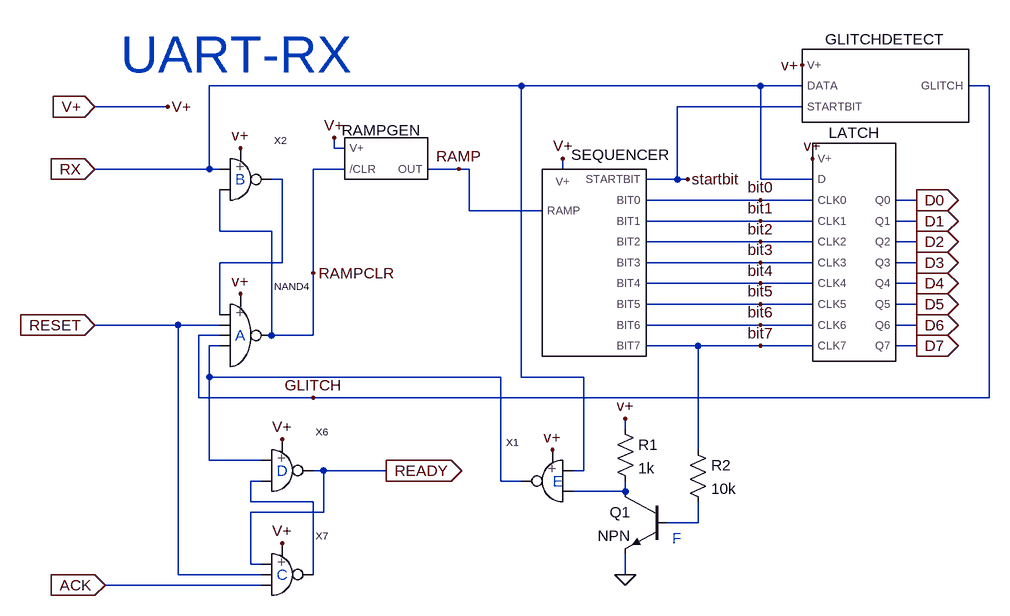
[diagram p0: schematic UART-RX.asc]
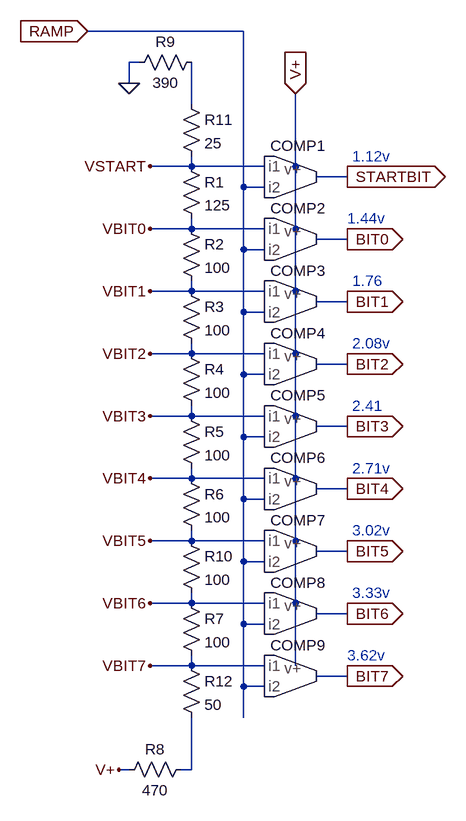
[diagram p1: sub-circuit uart-rx-sequencer.asc]
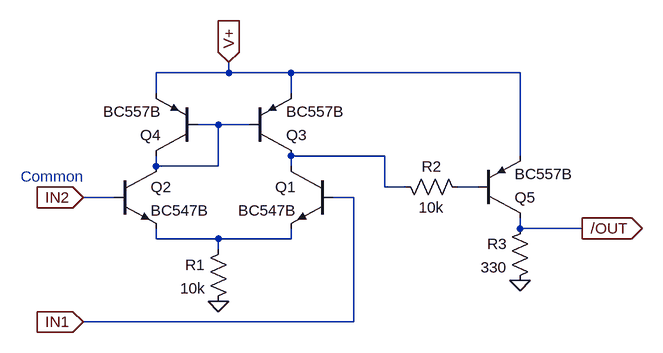
[diagram p2: sub-circuit comparator.asc]
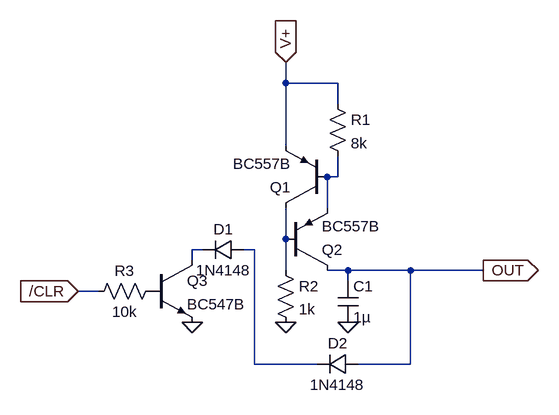
[diagram p3: sub-circuit rampgen.asc]
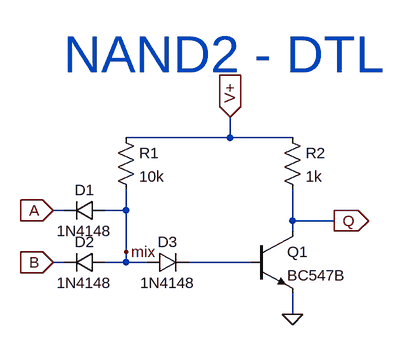
[diagram p4: sub-circuit nand2.asc]
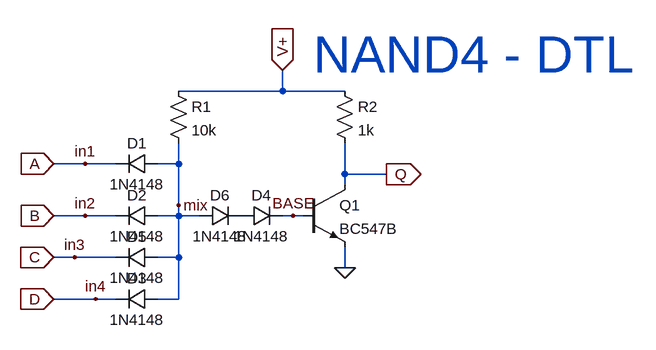
[diagram p5: sub-circuit nand4.asc]
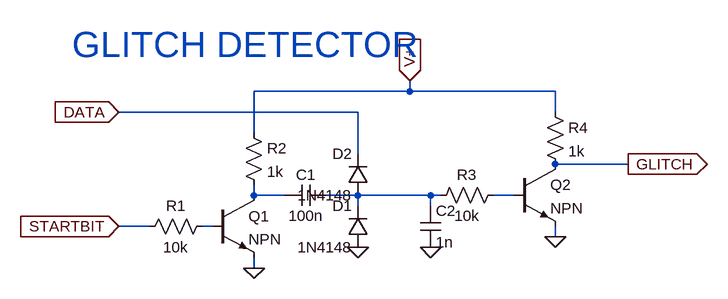
[diagram p6: sub-circuit glitchdetector.asc]
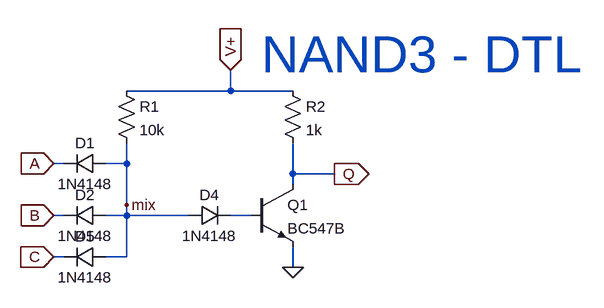
[diagram p7: sub-circuit nand3.asc]
UART-RX.asc, the LTspice schematic file:
Version 4
SHEET 1 1972 1096
WIRE 880 128 400 128
WIRE 1248 128 880 128
WIRE 1312 128 1248 128
WIRE 1600 128 1568 128
WIRE 336 160 224 160
WIRE 1312 160 1120 160
WIRE 592 224 592 208
WIRE 608 224 592 224
WIRE 400 256 400 128
WIRE 400 256 224 256
WIRE 416 256 400 256
WIRE 608 256 560 256
WIRE 784 256 736 256
WIRE 800 256 784 256
WIRE 944 256 944 240
WIRE 512 272 496 272
WIRE 1120 272 1120 160
WIRE 1120 272 1072 272
WIRE 1136 272 1120 272
WIRE 1248 272 1248 128
WIRE 1328 272 1248 272
WIRE 1248 304 1072 304
WIRE 1328 304 1248 304
WIRE 1488 304 1456 304
WIRE 800 320 800 256
WIRE 912 320 800 320
WIRE 1248 336 1072 336
WIRE 1328 336 1248 336
WIRE 1488 336 1456 336
WIRE 416 352 416 288
WIRE 496 352 416 352
WIRE 1248 368 1072 368
WIRE 1328 368 1248 368
WIRE 1488 368 1456 368
WIRE 512 400 512 272
WIRE 512 400 416 400
WIRE 1248 400 1072 400
WIRE 1328 400 1248 400
WIRE 1488 400 1456 400
WIRE 560 416 560 256
WIRE 1248 432 1072 432
WIRE 1328 432 1248 432
WIRE 1488 432 1456 432
WIRE 1248 464 1072 464
WIRE 1328 464 1248 464
WIRE 1488 464 1456 464
WIRE 416 480 416 400
WIRE 352 496 224 496
WIRE 416 496 352 496
WIRE 1248 496 1072 496
WIRE 1328 496 1248 496
WIRE 1488 496 1456 496
WIRE 416 512 384 512
WIRE 496 512 496 352
WIRE 560 512 560 416
WIRE 560 512 496 512
WIRE 416 528 400 528
WIRE 1152 528 1072 528
WIRE 1248 528 1152 528
WIRE 1328 528 1248 528
WIRE 1488 528 1456 528
WIRE 400 576 400 528
WIRE 848 576 400 576
WIRE 880 576 880 128
WIRE 976 576 880 576
WIRE 384 608 384 512
WIRE 560 608 384 608
WIRE 1600 608 1600 128
WIRE 1600 608 560 608
WIRE 1040 656 1040 640
WIRE 1152 688 1152 528
WIRE 400 704 400 576
WIRE 480 704 400 704
WIRE 576 720 560 720
WIRE 672 720 576 720
WIRE 976 720 976 576
WIRE 976 720 960 720
WIRE 480 736 464 736
WIRE 848 736 848 576
WIRE 880 736 848 736
WIRE 1040 752 1040 736
WIRE 1040 752 960 752
WIRE 464 768 464 736
WIRE 560 768 464 768
WIRE 576 784 576 720
WIRE 576 784 464 784
WIRE 1152 800 1152 768
WIRE 1152 800 1104 800
WIRE 464 864 464 784
WIRE 480 864 464 864
WIRE 352 880 352 496
WIRE 480 880 352 880
WIRE 560 880 560 768
WIRE 1040 880 1040 848
WIRE 480 896 240 896
FLAG 448 448 v+
FLAG 448 224 v+
FLAG 944 240 V+
FLAG 592 208 V+
FLAG 1312 96 v+
FLAG 512 672 V+
FLAG 512 832 V+
FLAG 672 720 READY
IOPIN 672 720 Out
FLAG 1136 272 startbit
FLAG 240 896 ACK
IOPIN 240 896 In
FLAG 224 256 RX
IOPIN 224 256 In
FLAG 224 496 RESET
IOPIN 224 496 In
FLAG 784 256 RAMP
FLAG 336 160 V+
FLAG 224 160 V+
IOPIN 224 160 In
FLAG 560 608 GLITCH
FLAG 1328 240 v+
FLAG 1488 304 D0
IOPIN 1488 304 Out
FLAG 1488 336 D1
IOPIN 1488 336 Out
FLAG 1488 368 D2
IOPIN 1488 368 Out
FLAG 1488 400 D3
IOPIN 1488 400 Out
FLAG 1488 432 D4
IOPIN 1488 432 Out
FLAG 1488 464 D5
IOPIN 1488 464 Out
FLAG 1488 496 D6
IOPIN 1488 496 Out
FLAG 1488 528 D7
IOPIN 1488 528 Out
FLAG 1248 304 bit0
FLAG 1248 336 bit1
FLAG 1248 368 bit2
FLAG 1248 400 bit3
FLAG 1248 432 bit4
FLAG 1248 464 bit5
FLAG 1248 496 bit6
FLAG 1248 528 bit7
FLAG 560 416 RAMPCLR
FLAG 928 688 v+
FLAG 1040 880 0
FLAG 1040 640 v+
SYMBOL UART-Rx-Sequencer 960 384 R0
WINDOW 0 72 -134 Bottom 2
SYMATTR InstName SEQUENCER
SYMBOL RampGen 656 256 R0
SYMATTR InstName RAMPGEN
SYMBOL NAND2 448 272 R0
SYMATTR InstName X2
SYMBOL NAND4 448 496 R0
SYMATTR InstName NAND4
SYMBOL GlitchDetector 1440 128 R0
SYMATTR InstName GLITCHDETECT
SYMBOL NAND2 512 720 R0
SYMATTR InstName X6
SYMBOL NAND3 512 880 R0
SYMATTR InstName X7
SYMBOL Octal-D-Latch 1392 384 R0
SYMATTR InstName LATCH
SYMBOL NAND2 928 736 M0
SYMATTR InstName X1
SYMBOL npn 1104 752 M0
SYMATTR InstName Q1
SYMBOL res 1024 640 R0
SYMATTR InstName R1
SYMATTR Value 1k
SYMBOL res 1136 672 R0
SYMATTR InstName R2
SYMATTR Value 10k
TEXT 264 80 Left 6 ;UART-RX
TEXT 440 512 Left 2 ;A
TEXT 440 272 Left 2 ;B
TEXT 504 880 Left 2 ;C
TEXT 504 720 Left 2 ;D
TEXT 928 736 Left 2 ;E
TEXT 1112 824 Left 2 ;F

uart-rx-sequencer.asc, the sub-circuit schematic file:
Version 4
SHEET 1 880 1152
WIRE 128 -192 -112 -192
WIRE -32 -144 -48 -144
WIRE -48 -112 -48 -144
WIRE 48 -80 48 -144
WIRE 48 16 48 0
WIRE 48 16 -16 16
WIRE 160 16 48 16
WIRE 208 16 208 -96
WIRE 288 32 240 32
WIRE 128 48 128 -192
WIRE 160 48 128 48
WIRE 48 112 48 96
WIRE 48 112 -16 112
WIRE 160 112 48 112
WIRE 208 112 208 16
WIRE 288 128 240 128
WIRE 128 144 128 48
WIRE 160 144 128 144
WIRE 48 208 48 192
WIRE 48 208 -16 208
WIRE 160 208 48 208
WIRE 208 208 208 112
WIRE 288 224 240 224
WIRE 128 240 128 144
WIRE 160 240 128 240
WIRE 48 304 48 288
WIRE 48 304 -16 304
WIRE 160 304 48 304
WIRE 208 304 208 208
WIRE 288 320 240 320
WIRE 128 336 128 240
WIRE 160 336 128 336
WIRE 48 400 48 384
WIRE 48 400 -16 400
WIRE 160 400 48 400
WIRE 208 400 208 304
WIRE 288 416 240 416
WIRE 128 432 128 336
WIRE 160 432 128 432
WIRE 48 496 48 480
WIRE 48 496 -16 496
WIRE 160 496 48 496
WIRE 208 496 208 400
WIRE 288 512 240 512
WIRE 128 528 128 432
WIRE 160 528 128 528
WIRE 48 592 48 576
WIRE 48 592 -16 592
WIRE 160 592 48 592
WIRE 208 592 208 496
WIRE 288 608 240 608
WIRE 128 624 128 528
WIRE 160 624 128 624
WIRE 48 688 48 672
WIRE 48 688 -16 688
WIRE 160 688 48 688
WIRE 208 688 208 592
WIRE 288 704 240 704
WIRE 128 720 128 624
WIRE 160 720 128 720
WIRE 48 784 48 768
WIRE 48 784 -16 784
WIRE 160 784 48 784
WIRE 208 784 208 688
WIRE 288 800 240 800
WIRE 128 816 128 720
WIRE 160 816 128 816
WIRE 128 864 128 816
WIRE -48 944 -64 944
WIRE 48 944 48 864
WIRE 48 944 32 944
FLAG 288 32 STARTBIT
IOPIN 288 32 Out
FLAG 288 128 BIT0
IOPIN 288 128 Out
FLAG 288 224 BIT1
IOPIN 288 224 Out
FLAG 288 320 BIT2
IOPIN 288 320 Out
FLAG 288 416 BIT3
IOPIN 288 416 Out
FLAG 288 512 BIT4
IOPIN 288 512 Out
FLAG 288 608 BIT5
IOPIN 288 608 Out
FLAG 288 704 BIT6
IOPIN 288 704 Out
FLAG 288 800 BIT7
IOPIN 288 800 Out
FLAG 208 -96 V+
IOPIN 208 -96 In
FLAG -112 -192 RAMP
IOPIN -112 -192 In
FLAG -48 -112 0
FLAG -64 944 V+
FLAG -16 16 VSTART
FLAG -16 112 VBIT0
FLAG -16 208 VBIT1
FLAG -16 304 VBIT2
FLAG -16 400 VBIT3
FLAG -16 496 VBIT4
FLAG -16 592 VBIT5
FLAG -16 688 VBIT6
FLAG -16 784 VBIT7
SYMBOL res 32 0 R0
SYMATTR InstName R1
SYMATTR Value 125
SYMBOL res 32 96 R0
SYMATTR InstName R2
SYMATTR Value 100
SYMBOL res 32 192 R0
SYMATTR InstName R3
SYMATTR Value 100
SYMBOL res 32 288 R0
SYMATTR InstName R4
SYMATTR Value 100
SYMBOL res 32 384 R0
SYMATTR InstName R5
SYMATTR Value 100
SYMBOL res 32 480 R0
SYMATTR InstName R6
SYMATTR Value 100
SYMBOL res 32 672 R0
SYMATTR InstName R7
SYMATTR Value 100
SYMBOL res 48 928 R90
WINDOW 0 0 56 VBottom 2
WINDOW 3 32 56 VTop 2
SYMATTR InstName R8
SYMATTR Value 470
SYMBOL res -48 -128 R270
WINDOW 0 32 56 VTop 2
WINDOW 3 0 56 VBottom 2
SYMATTR InstName R9
SYMATTR Value 390
SYMBOL res 32 576 R0
SYMATTR InstName R10
SYMATTR Value 100
SYMBOL Comparator 240 32 R0
SYMATTR InstName COMP1
SYMBOL Comparator 240 128 R0
SYMATTR InstName COMP2
SYMBOL Comparator 240 224 R0
SYMATTR InstName COMP3
SYMBOL Comparator 240 320 R0
SYMATTR InstName COMP4
SYMBOL Comparator 240 416 R0
SYMATTR InstName COMP5
SYMBOL Comparator 240 512 R0
SYMATTR InstName COMP6
SYMBOL Comparator 240 608 R0
SYMATTR InstName COMP7
SYMBOL Comparator 240 704 R0
SYMATTR InstName COMP8
SYMBOL Comparator 240 800 R0
SYMATTR InstName COMP9
SYMBOL res 32 -96 R0
SYMATTR InstName R11
SYMATTR Value 25
SYMBOL res 32 768 R0
SYMATTR InstName R12
SYMATTR Value 50
TEXT 296 0 Left 2 ;1.12v
TEXT 288 96 Left 2 ;1.44v
TEXT 296 192 Left 2 ;1.76
TEXT 296 288 Left 2 ;2.08v
TEXT 296 384 Left 2 ;2.41
TEXT 296 480 Left 2 ;2.71v
TEXT 296 576 Left 2 ;3.02v
TEXT 296 672 Left 2 ;3.33v
TEXT 288 768 Left 2 ;3.62v

comparator.asc, the sub-circuit schematic file:
Version 4
SHEET 1 1272 680
WIRE -32 -16 -32 -32
WIRE -32 -16 -144 -16
WIRE 64 -16 -32 -16
WIRE 416 -16 64 -16
WIRE -144 16 -144 -16
WIRE 64 16 64 -16
WIRE -48 64 -80 64
WIRE 0 64 -48 64
WIRE 208 112 64 112
WIRE 416 112 416 -16
WIRE -144 128 -144 112
WIRE -48 128 -48 64
WIRE -48 128 -144 128
WIRE 64 128 64 112
WIRE 208 160 208 112
WIRE 240 160 208 160
WIRE 352 160 320 160
WIRE -208 176 -256 176
WIRE 160 176 128 176
WIRE 416 224 416 208
WIRE 512 224 416 224
WIRE -144 240 -144 224
WIRE -48 240 -144 240
WIRE 64 240 64 224
WIRE 64 240 -48 240
WIRE -48 256 -48 240
WIRE 160 368 160 176
WIRE 160 368 -256 368
FLAG -48 336 0
FLAG 416 304 0
FLAG 512 224 /OUT
IOPIN 512 224 Out
FLAG -32 -32 V+
IOPIN -32 -32 In
FLAG -256 176 IN2
IOPIN -256 176 In
FLAG -256 368 IN1
IOPIN -256 368 In
SYMBOL npn 128 128 M0
SYMATTR InstName Q1
SYMATTR Value BC547B
SYMBOL pnp -80 112 R180
SYMATTR InstName Q4
SYMATTR Value BC557B
SYMBOL res -32 240 M0
SYMATTR InstName R1
SYMATTR Value 10k
SYMBOL npn -208 128 R0
SYMATTR InstName Q2
SYMATTR Value BC547B
SYMBOL res 432 208 M0
SYMATTR InstName R3
SYMATTR Value 330
SYMBOL res 224 144 M90
WINDOW 0 0 56 VBottom 2
WINDOW 3 32 56 VTop 2
SYMATTR InstName R2
SYMATTR Value 10k
SYMBOL pnp 0 112 M180
SYMATTR InstName Q3
SYMATTR Value BC557B
SYMBOL pnp 352 208 M180
SYMATTR InstName Q5
SYMATTR Value BC557B
TEXT -352 144 Left 2 ;Common

rampgen.asc, the sub-circuit schematic file:
Version 4
SHEET 1 1276 1184
WIRE 832 -64 832 -96
WIRE 912 -64 832 -64
WIRE 912 -32 912 -64
WIRE 832 32 832 -64
WIRE 912 80 912 48
WIRE 912 80 896 80
WIRE 896 128 896 80
WIRE 832 176 832 128
WIRE 704 192 688 192
WIRE 784 192 768 192
WIRE 688 208 688 192
WIRE 832 224 832 176
WIRE 928 224 896 224
WIRE 1024 224 928 224
WIRE 1136 224 1024 224
WIRE 928 240 928 224
WIRE 544 256 512 256
WIRE 784 368 784 192
WIRE 880 368 784 368
WIRE 1024 368 1024 224
WIRE 1024 368 944 368
FLAG 688 304 0
FLAG 512 256 /CLR
IOPIN 512 256 In
FLAG 832 304 0
FLAG 832 -96 V+
IOPIN 832 -96 In
FLAG 928 304 0
FLAG 1136 224 OUT
IOPIN 1136 224 Out
SYMBOL npn 624 208 R0
SYMATTR InstName Q3
SYMATTR Value BC547B
SYMBOL res 640 240 R90
WINDOW 0 0 56 VBottom 2
WINDOW 3 32 56 VTop 2
SYMATTR InstName R3
SYMATTR Value 10k
SYMBOL pnp 832 224 M180
SYMATTR InstName Q2
SYMATTR Value BC557B
SYMBOL pnp 896 128 R180
SYMATTR InstName Q1
SYMATTR Value BC557B
SYMBOL res 816 208 R0
SYMATTR InstName R2
SYMATTR Value 1k
SYMBOL cap 912 240 R0
SYMATTR InstName C1
SYMATTR Value 1µ
SYMBOL res 896 -48 R0
SYMATTR InstName R1
SYMATTR Value 8k
SYMBOL diode 768 176 R90
WINDOW 0 0 32 VBottom 2
WINDOW 3 32 32 VTop 2
SYMATTR InstName D1
SYMATTR Value 1N4148
SYMBOL diode 944 352 R90
WINDOW 0 0 32 VBottom 2
WINDOW 3 32 32 VTop 2
SYMATTR InstName D2
SYMATTR Value 1N4148

nand2.asc, the sub-circuit schematic file:
Version 4
SHEET 1 880 680
WIRE 288 -48 288 -80
WIRE 288 -48 128 -48
WIRE 384 -48 288 -48
WIRE 32 64 16 64
WIRE 128 64 128 32
WIRE 128 64 96 64
WIRE 384 80 384 32
WIRE 448 80 384 80
WIRE 384 96 384 80
WIRE 128 128 128 64
WIRE 32 144 16 144
WIRE 128 144 128 128
WIRE 128 144 96 144
WIRE 160 144 128 144
WIRE 320 144 224 144
WIRE 384 224 384 192
FLAG 384 224 0
FLAG 448 80 Q
IOPIN 448 80 Out
FLAG 16 64 A
IOPIN 16 64 In
FLAG 16 144 B
IOPIN 16 144 In
FLAG 288 -80 V+
IOPIN 288 -80 In
FLAG 128 128 mix
SYMBOL diode 96 48 R90
WINDOW 0 0 32 VBottom 2
WINDOW 3 32 32 VTop 2
SYMATTR InstName D1
SYMATTR Value 1N4148
SYMBOL res 112 -64 R0
SYMATTR InstName R1
SYMATTR Value 10k
SYMBOL npn 320 96 R0
SYMATTR InstName Q1
SYMATTR Value BC547B
SYMBOL res 368 -64 R0
SYMATTR InstName R2
SYMATTR Value 1k
SYMBOL diode 96 128 R90
WINDOW 0 0 32 VBottom 2
WINDOW 3 32 32 VTop 2
SYMATTR InstName D2
SYMATTR Value 1N4148
SYMBOL diode 160 160 R270
WINDOW 0 32 32 VTop 2
WINDOW 3 0 32 VBottom 2
SYMATTR InstName D3
SYMATTR Value 1N4148
TEXT 32 -176 Left 6 ;NAND2 - DTL

nand4.asc, the sub-circuit schematic file:
Version 4
SHEET 1 880 680
WIRE 288 -48 288 -80
WIRE 288 -48 128 -48
WIRE 384 -48 288 -48
WIRE -16 64 -64 64
WIRE 32 64 -16 64
WIRE 128 64 128 32
WIRE 128 64 96 64
WIRE 384 80 384 32
WIRE 448 80 384 80
WIRE 384 96 384 80
WIRE 128 128 128 64
WIRE -16 144 -64 144
WIRE 32 144 -16 144
WIRE 128 144 128 128
WIRE 128 144 96 144
WIRE 160 144 128 144
WIRE 304 144 288 144
WIRE 320 144 304 144
WIRE -32 208 -64 208
WIRE 32 208 -32 208
WIRE 128 208 128 144
WIRE 128 208 96 208
WIRE 384 224 384 192
WIRE 0 272 -64 272
WIRE 32 272 0 272
WIRE 128 272 128 208
WIRE 128 272 96 272
FLAG 384 224 0
FLAG 448 80 Q
IOPIN 448 80 Out
FLAG -64 64 A
IOPIN -64 64 In
FLAG -64 144 B
IOPIN -64 144 In
FLAG 288 -80 V+
IOPIN 288 -80 In
FLAG 128 128 mix
FLAG -64 208 C
IOPIN -64 208 In
FLAG -64 272 D
IOPIN -64 272 In
FLAG 304 144 BASE
FLAG -16 64 in1
FLAG -16 144 in2
FLAG -32 208 in3
FLAG 0 272 in4
SYMBOL diode 96 48 R90
WINDOW 0 0 32 VBottom 2
WINDOW 3 32 32 VTop 2
SYMATTR InstName D1
SYMATTR Value 1N4148
SYMBOL res 112 -64 R0
SYMATTR InstName R1
SYMATTR Value 10k
SYMBOL npn 320 96 R0
SYMATTR InstName Q1
SYMATTR Value BC547B
SYMBOL res 368 -64 R0
SYMATTR InstName R2
SYMATTR Value 1k
SYMBOL diode 96 128 R90
WINDOW 0 0 32 VBottom 2
WINDOW 3 32 32 VTop 2
SYMATTR InstName D2
SYMATTR Value 1N4148
SYMBOL diode 224 160 R270
WINDOW 0 32 32 VTop 2
WINDOW 3 0 32 VBottom 2
SYMATTR InstName D4
SYMATTR Value 1N4148
SYMBOL diode 96 192 R90
WINDOW 0 0 32 VBottom 2
WINDOW 3 32 32 VTop 2
SYMATTR InstName D5
SYMATTR Value 1N4148
SYMBOL diode 96 256 R90
WINDOW 0 0 32 VBottom 2
WINDOW 3 32 32 VTop 2
SYMATTR InstName D3
SYMATTR Value 1N4148
SYMBOL diode 160 160 R270
WINDOW 0 32 32 VTop 2
WINDOW 3 0 32 VBottom 2
SYMATTR InstName D6
SYMATTR Value 1N4148
TEXT 336 -104 Left 6 ;NAND4 - DTL

glitchdetector.asc, the sub-circuit schematic file:
Version 4
SHEET 1 880 680
WIRE 256 -112 256 -128
WIRE 256 -112 16 -112
WIRE 480 -112 256 -112
WIRE 176 -80 -192 -80
WIRE 480 -80 480 -112
WIRE 16 -48 16 -112
WIRE 176 -16 176 -80
WIRE 592 0 480 0
WIRE 16 48 16 32
WIRE 64 48 16 48
WIRE 176 48 128 48
WIRE 288 48 176 48
WIRE 304 48 288 48
WIRE 416 48 384 48
WIRE 176 64 176 48
WIRE 288 64 288 48
WIRE -144 96 -192 96
WIRE -48 96 -64 96
WIRE 480 112 480 96
WIRE 16 160 16 144
FLAG 176 128 0
FLAG 480 112 0
FLAG 16 160 0
FLAG -192 96 STARTBIT
IOPIN -192 96 In
FLAG 256 -128 V+
IOPIN 256 -128 In
FLAG 592 0 GLITCH
IOPIN 592 0 Out
FLAG -192 -80 DATA
IOPIN -192 -80 In
FLAG 288 128 0
SYMBOL cap 128 32 R90
WINDOW 0 0 32 VBottom 2
WINDOW 3 32 32 VTop 2
SYMATTR InstName C1
SYMATTR Value 100n
SYMBOL diode 192 128 R180
WINDOW 0 24 64 Left 2
WINDOW 3 24 0 Left 2
SYMATTR InstName D1
SYMATTR Value 1N4148
SYMBOL diode 192 48 R180
WINDOW 0 24 64 Left 2
WINDOW 3 24 0 Left 2
SYMATTR InstName D2
SYMATTR Value 1N4148
SYMBOL npn 416 0 R0
SYMATTR InstName Q2
SYMBOL res 288 64 R270
WINDOW 0 32 56 VTop 2
WINDOW 3 0 56 VBottom 2
SYMATTR InstName R3
SYMATTR Value 10k
SYMBOL res 464 -96 R0
SYMATTR InstName R4
SYMATTR Value 1k
SYMBOL npn -48 48 R0
SYMATTR InstName Q1
SYMBOL res -160 112 R270
WINDOW 0 32 56 VTop 2
WINDOW 3 0 56 VBottom 2
SYMATTR InstName R1
SYMATTR Value 10k
SYMBOL res 0 -64 R0
SYMATTR InstName R2
SYMATTR Value 1k
SYMBOL cap 272 64 R0
SYMATTR InstName C2
SYMATTR Value 1n
TEXT -264 -184 Left 5 ;GLITCH DETECTOR

nand3.asc, the sub-circuit schematic file:
Version 4
SHEET 1 880 680
WIRE 288 -48 288 -80
WIRE 288 -48 128 -48
WIRE 384 -48 288 -48
WIRE 32 64 16 64
WIRE 128 64 128 32
WIRE 128 64 96 64
WIRE 384 80 384 32
WIRE 448 80 384 80
WIRE 384 96 384 80
WIRE 128 128 128 64
WIRE 32 144 16 144
WIRE 128 144 128 128
WIRE 128 144 96 144
WIRE 224 144 128 144
WIRE 320 144 288 144
WIRE 32 208 16 208
WIRE 128 208 128 144
WIRE 128 208 96 208
WIRE 384 224 384 192
FLAG 384 224 0
FLAG 448 80 Q
IOPIN 448 80 Out
FLAG 16 64 A
IOPIN 16 64 In
FLAG 16 144 B
IOPIN 16 144 In
FLAG 288 -80 V+
IOPIN 288 -80 In
FLAG 128 128 mix
FLAG 16 208 C
IOPIN 16 208 In
SYMBOL diode 96 48 R90
WINDOW 0 0 32 VBottom 2
WINDOW 3 32 32 VTop 2
SYMATTR InstName D1
SYMATTR Value 1N4148
SYMBOL res 112 -64 R0
SYMATTR InstName R1
SYMATTR Value 10k
SYMBOL npn 320 96 R0
SYMATTR InstName Q1
SYMATTR Value BC547B
SYMBOL res 368 -64 R0
SYMATTR InstName R2
SYMATTR Value 1k
SYMBOL diode 96 128 R90
WINDOW 0 0 32 VBottom 2
WINDOW 3 32 32 VTop 2
SYMATTR InstName D2
SYMATTR Value 1N4148
SYMBOL diode 224 160 R270
WINDOW 0 32 32 VTop 2
WINDOW 3 0 32 VBottom 2
SYMATTR InstName D4
SYMATTR Value 1N4148
SYMBOL diode 96 192 R90
WINDOW 0 0 32 VBottom 2
WINDOW 3 32 32 VTop 2
SYMATTR InstName D5
SYMATTR Value 1N4148
TEXT 336 -104 Left 6 ;NAND3 - DTL

octal-d-latch.asc, the sub-circuit schematic file:
Version 4
SHEET 1 880 680
WIRE -112 64 -160 64
WIRE -80 112 -160 112
WIRE -32 112 -80 112
WIRE 368 112 320 112
WIRE -32 144 -160 144
WIRE 112 144 80 144
WIRE 368 144 288 144
WIRE 512 144 480 144
WIRE -80 240 -80 112
WIRE -32 240 -80 240
WIRE 320 240 320 112
WIRE 368 240 320 240
WIRE -32 272 -160 272
WIRE 112 272 80 272
WIRE 368 272 288 272
WIRE 512 272 480 272
WIRE -80 368 -80 240
WIRE -32 368 -80 368
WIRE 320 368 320 240
WIRE 368 368 320 368
WIRE -32 400 -160 400
WIRE 112 400 80 400
WIRE 368 400 288 400
WIRE 512 400 480 400
WIRE -80 496 -80 368
WIRE -32 496 -80 496
WIRE 320 496 320 368
WIRE 368 496 320 496
WIRE -32 528 -160 528
WIRE 112 528 80 528
WIRE 368 528 288 528
WIRE 512 528 480 528
WIRE -80 576 -80 496
WIRE 320 576 320 496
WIRE 320 576 -80 576
FLAG -32 80 V+
FLAG -32 208 V+
FLAG -32 336 V+
FLAG -32 464 V+
FLAG 368 80 V+
FLAG 368 208 V+
FLAG 368 336 V+
FLAG 368 464 V+
FLAG -160 112 D
IOPIN -160 112 In
FLAG -112 64 V+
FLAG -160 64 V+
IOPIN -160 64 In
FLAG 512 528 Q7
IOPIN 512 528 Out
FLAG 512 400 Q6
IOPIN 512 400 Out
FLAG 512 272 Q5
IOPIN 512 272 Out
FLAG 512 144 Q4
IOPIN 512 144 Out
FLAG 112 144 Q0
IOPIN 112 144 Out
FLAG 112 272 Q1
IOPIN 112 272 Out
FLAG 112 400 Q2
IOPIN 112 400 Out
FLAG 112 528 Q3
IOPIN 112 528 Out
FLAG -160 144 CLK0
IOPIN -160 144 In
FLAG -160 272 CLK1
IOPIN -160 272 In
FLAG -160 400 CLK2
IOPIN -160 400 In
FLAG -160 528 CLK3
IOPIN -160 528 In
FLAG 288 144 CLK4
IOPIN 288 144 In
FLAG 288 272 CLK5
IOPIN 288 272 In
FLAG 288 400 CLK6
IOPIN 288 400 In
FLAG 288 528 CLK7
IOPIN 288 528 In
SYMBOL D-LATCH 16 128 R0
SYMATTR InstName X1
SYMBOL D-LATCH 16 256 R0
SYMATTR InstName X2
SYMBOL D-LATCH 16 384 R0
SYMATTR InstName X3
SYMBOL D-LATCH 16 512 R0
SYMATTR InstName X4
SYMBOL D-LATCH 416 128 R0
SYMATTR InstName X5
SYMBOL D-LATCH 416 256 R0
SYMATTR InstName X6
SYMBOL D-LATCH 416 384 R0
SYMATTR InstName X7
SYMBOL D-LATCH 416 512 R0
SYMATTR InstName X8

d-latch.asc, the sub-circuit schematic file:
Version 4
SHEET 1 880 680
WIRE 128 176 96 176
WIRE 160 224 96 224
WIRE 320 224 304 224
WIRE 304 240 304 224
WIRE 304 240 240 240
WIRE 416 240 400 240
WIRE 464 240 416 240
WIRE 112 256 96 256
WIRE 160 256 112 256
WIRE 240 288 240 240
WIRE 240 288 144 288
WIRE 320 288 320 256
WIRE 400 288 320 288
WIRE 416 304 416 240
WIRE 416 304 320 304
WIRE 320 368 320 304
WIRE 144 384 144 288
WIRE 160 384 144 384
WIRE 400 384 400 288
WIRE 464 384 400 384
WIRE 320 400 240 400
WIRE 112 416 112 256
WIRE 160 416 112 416
FLAG 352 192 v+
FLAG 96 176 v+
IOPIN 96 176 In
FLAG 192 192 v+
FLAG 464 384 /Q
IOPIN 464 384 Out
FLAG 464 240 Q
IOPIN 464 240 Out
FLAG 96 224 D
IOPIN 96 224 In
FLAG 96 256 clk
IOPIN 96 256 In
FLAG 128 176 V+
FLAG 192 352 V+
FLAG 352 336 V+
SYMBOL NAND2 352 240 R0
SYMATTR InstName X1
SYMBOL NAND2 352 384 R0
SYMATTR InstName X2
SYMBOL NAND2 192 240 R0
SYMATTR InstName X3
SYMBOL NAND2 192 400 R0
SYMATTR InstName X4

The netlist it stands for:
* UART-RX.asc
XSEQUENCER startbit bit0 bit1 bit2 bit3 bit4 bit5 bit6 v+ RAMP bit7 uart-rx-sequencer
XRAMPGEN RAMPCLR v+ RAMP rampgen
XX2 RX RAMPCLR N001 v+ nand2
XNAND4 N001 RESET GLITCH RAMPCLR v+ N002 nand4
XGLITCHDETECT RX startbit v+ GLITCH glitchdetector
XX6 N002 N003 READY v+ nand2
XX7 READY RESET ACK N003 v+ nand3
XLATCH bit0 bit1 bit2 bit3 bit4 bit5 bit6 bit7 RX v+ D0 D1 D2 D3 D4 D5 D6 D7 octal-d-latch
XX1 RX N004 N002 v+ nand2
Q1 N004 N005 0 0 NPN
R1 v+ N004 1k
R2 bit7 N005 10k

* block symbol definitions
.subckt uart-rx-sequencer STARTBIT BIT0 BIT1 BIT2 BIT3 BIT4 BIT5 BIT6 V+ RAMP BIT7
R1 VSTART VBIT0 125
R2 VBIT0 VBIT1 100
R3 VBIT1 VBIT2 100
R4 VBIT2 VBIT3 100
R5 VBIT3 VBIT4 100
R6 VBIT4 VBIT5 100
R7 VBIT6 VBIT7 100
R8 N002 V+ 470
R9 0 N001 390
R10 VBIT5 VBIT6 100
XCOMP1 VSTART RAMP V+ STARTBIT comparator
XCOMP2 VBIT0 RAMP V+ BIT0 comparator
XCOMP3 VBIT1 RAMP V+ BIT1 comparator
XCOMP4 VBIT2 RAMP V+ BIT2 comparator
XCOMP5 VBIT3 RAMP V+ BIT3 comparator
XCOMP6 VBIT4 RAMP V+ BIT4 comparator
XCOMP7 VBIT5 RAMP V+ BIT5 comparator
XCOMP8 VBIT6 RAMP V+ BIT6 comparator
XCOMP9 VBIT7 RAMP V+ BIT7 comparator
R11 N001 VSTART 25
R12 VBIT7 N002 50
* 1.12v
* 1.44v
* 1.76
* 2.08v
* 2.41
* 2.71v
* 3.02v
* 3.33v
* 3.62v
.ends uart-rx-sequencer

.subckt comparator IN1 IN2 V+ /OUT
Q1 N002 IN1 N004 0 BC547B
Q4 N001 N001 V+ 0 BC557B
R1 N004 0 10k
Q2 N001 IN2 N004 0 BC547B
R3 /OUT 0 330
R2 N002 N003 10k
Q3 N002 N001 V+ 0 BC557B
Q5 /OUT N003 V+ 0 BC557B
* Common
.ends comparator

.subckt rampgen /CLR V+ OUT
Q3 N003 P001 0 0 BC547B
R3 P001 /CLR 10k
Q2 OUT N002 N001 0 BC557B
Q1 N002 N001 V+ 0 BC557B
R2 N002 0 1k
C1 OUT 0 1µ
R1 V+ N001 8k
D1 N004 N003 1N4148
D2 OUT N004 1N4148
.ends rampgen

.subckt nand2 A B Q V+
D1 mix A 1N4148
R1 V+ mix 10k
Q1 Q N001 0 0 BC547B
R2 V+ Q 1k
D2 mix B 1N4148
D3 mix N001 1N4148
* NAND2 - DTL
.ends nand2

.subckt nand4 A B C Q V+ D
D1 mix A 1N4148
R1 V+ mix 10k
Q1 Q BASE 0 0 BC547B
R2 V+ Q 1k
D2 mix B 1N4148
D4 P001 BASE 1N4148
D5 mix C 1N4148
D3 mix D 1N4148
D6 mix P001 1N4148
* NAND4 - DTL
.ends nand4

.subckt glitchdetector DATA STARTBIT V+ GLITCH
C1 N002 N001 100n
D1 0 N002 1N4148
D2 N002 DATA 1N4148
Q2 GLITCH N003 0 0 NPN
R3 N002 N003 10k
R4 V+ GLITCH 1k
Q1 N001 N004 0 0 NPN
R1 STARTBIT N004 10k
R2 V+ N001 1k
C2 N002 0 1n
* GLITCH DETECTOR
.ends glitchdetector

.subckt nand3 A B C Q V+
D1 mix A 1N4148
R1 V+ mix 10k
Q1 Q N001 0 0 BC547B
R2 V+ Q 1k
D2 mix B 1N4148
D4 mix N001 1N4148
D5 mix C 1N4148
* NAND3 - DTL
.ends nand3

.subckt octal-d-latch CLK0 CLK1 CLK2 CLK3 CLK4 CLK5 CLK6 CLK7 D V+ Q0 Q1 Q2 Q3 Q4 Q5 Q6 Q7
XX1 CLK0 D V+ NC_01 Q0 d-latch
XX2 CLK1 D V+ NC_02 Q1 d-latch
XX3 CLK2 D V+ NC_03 Q2 d-latch
XX4 CLK3 D V+ NC_04 Q3 d-latch
XX5 CLK4 D V+ NC_05 Q4 d-latch
XX6 CLK5 D V+ NC_06 Q5 d-latch
XX7 CLK6 D V+ NC_07 Q6 d-latch
XX8 CLK7 D V+ NC_08 Q7 d-latch
.ends octal-d-latch

.subckt d-latch clk D v+ /Q Q
XX1 N001 /Q Q v+ nand2
XX2 Q N002 /Q v+ nand2
XX3 D clk N001 v+ nand2
XX4 N001 clk N002 v+ nand2
.ends d-latch

.model D D
.lib standard.dio
.model NPN NPN
.model PNP PNP
.lib standard.bjt
* UART-RX
* A
* B
* C
* D
* E
* F
.backanno
.end